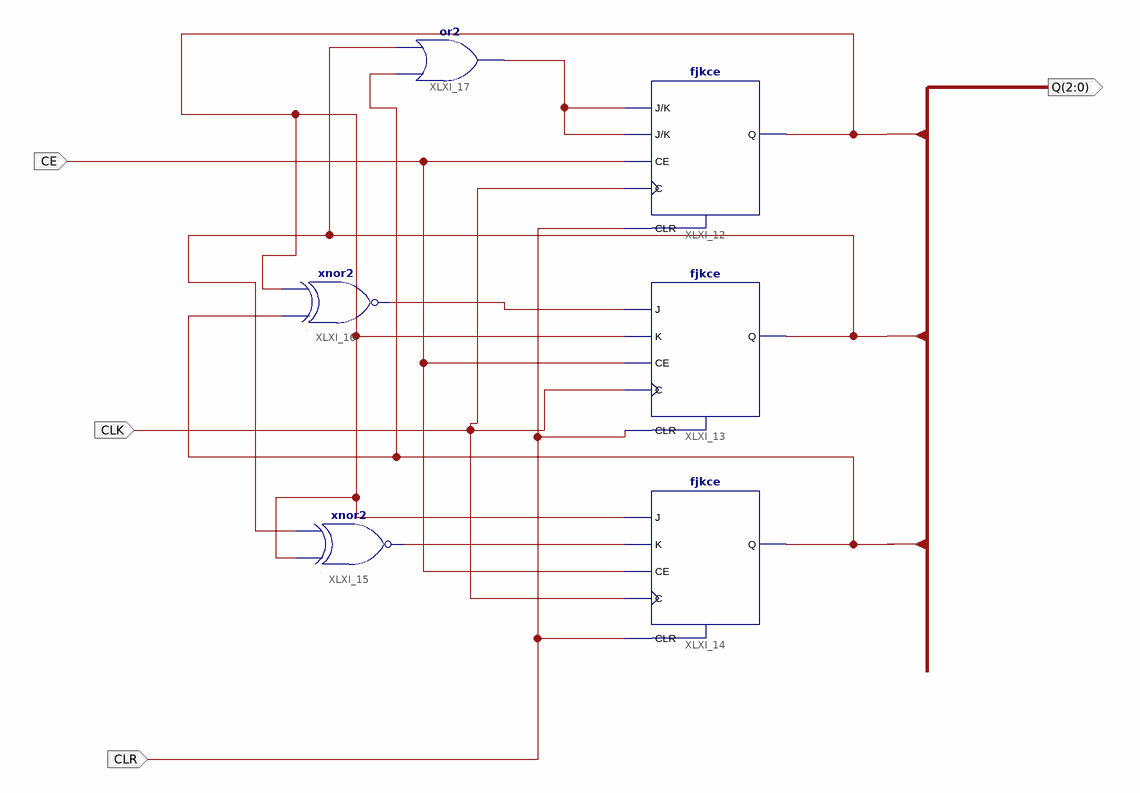
[diagram p0: schematic sheet 1]
// Xilinx ISE schematic lab3_zad1.sch (xc9500xl) as structural Verilog: 6 symbols, 4 ports
module lab3_zad1 (
  input  CLK,
  input  CLR,
  input  CE,
  output [2:0] Q
);

  wire XLXN_45, XLXN_47, XLXN_50;

  fjkce XLXI_12 (.C(CLK), .CE(CE), .CLR(CLR), .J(XLXN_50), .K(XLXN_50), .Q(Q[0]));
  fjkce XLXI_13 (.C(CLK), .CE(CE), .CLR(CLR), .J(XLXN_47), .K(Q[0]), .Q(Q[1]));
  fjkce XLXI_14 (.C(CLK), .CE(CE), .CLR(CLR), .J(Q[0]), .K(XLXN_45), .Q(Q[2]));
  xnor XLXI_15 (XLXN_45, Q[0], Q[1]);
  xnor XLXI_16 (XLXN_47, Q[2], Q[0]);
  or XLXI_17 (XLXN_50, Q[2], Q[1]);
endmodule
